# Altium schematic sheet greenhouseSchematic.SchDoc: Greenhouse Project
size 508 x 279 mm; SheetNumber: 1; SheetTotal: 1
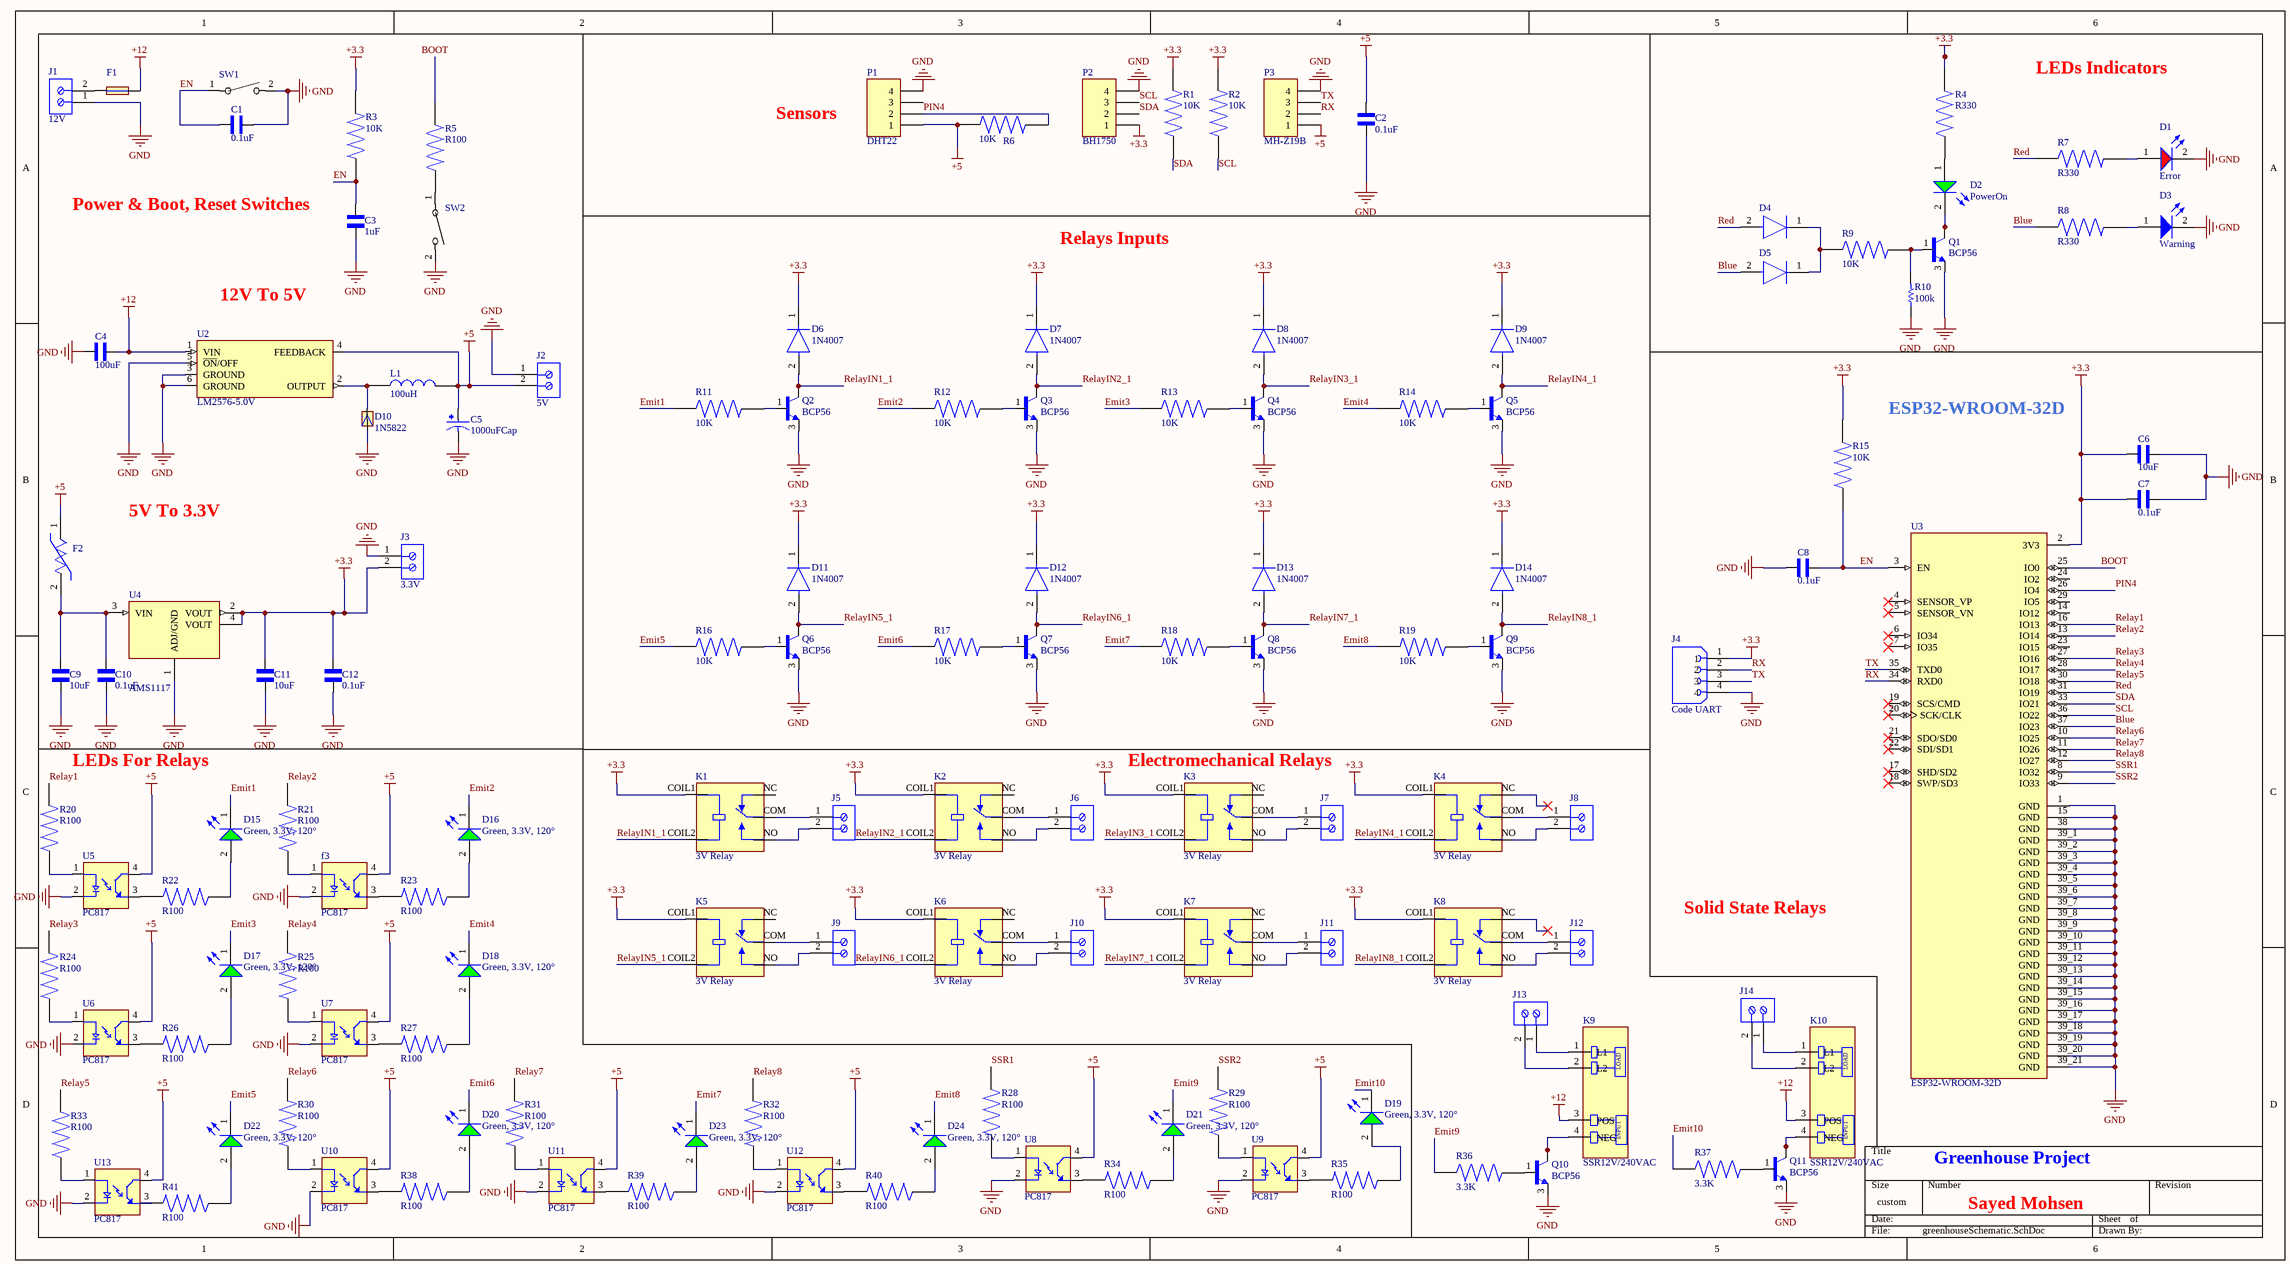
[diagram p0: greenhouseSchematic.SchDoc]

## Parts
C1  0.1uF  [Capacitor0.1uF]
C2  0.1uF  [Capacitor0.1uF]
C3  1uF  [CAPACITOR1UF]
C4  100uF  [Capacitor10uF]
C5  1000uFCap  [1000uFCap]
C6  10uF  [Capacitor10uF]
C7  0.1uF  [Capacitor0.1uF]
C8  0.1uF  [Capacitor0.1uF]
C9  10uF  [Capacitor10uF]
C10  0.1uF  [Capacitor0.1uF]
C11  10uF  [Capacitor10uF]
C12  0.1uF  [Capacitor0.1uF]
D1  Error  [redLed]
D2  PowerOn  [greenLed]
D3  Warning  [blueLed]
D4  1N4007  [1N4007]  (value not drawn)
D5  1N4007  [1N4007]  (value not drawn)
D6  1N4007  [1N4007]
D7  1N4007  [1N4007]
D8  1N4007  [1N4007]
D9  1N4007  [1N4007]
D10  1N5822  [1N5822Diode]
D11  1N4007  [1N4007]
D12  1N4007  [1N4007]
D13  1N4007  [1N4007]
D14  1N4007  [1N4007]
D15  Green, 3.3V, 120°  [newgreenled]
D16  Green, 3.3V, 120°  [newgreenled]
D17  Green, 3.3V, 120°  [newgreenled]
D18  Green, 3.3V, 120°  [newgreenled]
D19  Green, 3.3V, 120°  [newgreenled]
D20  Green, 3.3V, 120°  [newgreenled]
D21  Green, 3.3V, 120°  [newgreenled]
D22  Green, 3.3V, 120°  [newgreenled]
D23  Green, 3.3V, 120°  [newgreenled]
D24  Green, 3.3V, 120°  [newgreenled]
F1  1812L200/12DR  [FUSE_1812L200/12DR]  (value not drawn)
F2  0ZCK0075FF2E  [ptc6v]  (value not drawn)
f3  PC817  [PC817]
J1  12V  [screw]
J2  5V  [screw]
J3  3.3V  [screw]
J4  Code UART  [Fpinheader]
J5  (no value)  [screw]
J6  (no value)  [screw]
J7  (no value)  [screw]
J8  (no value)  [screw]
J9  (no value)  [screw]
J10  (no value)  [screw]
J11  (no value)  [screw]
J12  (no value)  [screw]
J13  (no value)  [screw]
J14  (no value)  [screw]
K1  3V Relay  [3V Relay]
K2  3V Relay  [3V Relay]
K3  3V Relay  [3V Relay]
K4  3V Relay  [3V Relay]
K5  3V Relay  [3V Relay]
K6  3V Relay  [3V Relay]
K7  3V Relay  [3V Relay]
K8  3V Relay  [3V Relay]
K9  SSR12V/240VAC  [SSR12V/240VAC]
K10  SSR12V/240VAC  [SSR12V/240VAC]
L1  100uH  [100uH Inductor]
P1  DHT22  [HDR1X4]
P2  BH1750  [HDR1X4]
P3  MH-Z19B  [HDR1X4]
Q1  BCP56  [BCP56]
Q2  BCP56  [BCP56]
Q3  BCP56  [BCP56]
Q4  BCP56  [BCP56]
Q5  BCP56  [BCP56]
Q6  BCP56  [BCP56]
Q7  BCP56  [BCP56]
Q8  BCP56  [BCP56]
Q9  BCP56  [BCP56]
Q10  BCP56  [BCP56]
Q11  BCP56  [BCP56]
R1  10K  [Resistor10K]
R2  10K  [Resistor10K]
R3  10K  [Resistor10K]
R4  R330  [R100]
R5  R100  [R100]
R6  10K  [Resistor10K]
R7  R330  [R100]
R8  R330  [R100]
R9  10K  [Resistor10K]
R10  100k  [RESC1608X55X30ML15T15]
R11  10K  [Resistor10K]
R12  10K  [Resistor10K]
R13  10K  [Resistor10K]
R14  10K  [Resistor10K]
R15  10K  [Resistor10K]
R16  10K  [Resistor10K]
R17  10K  [Resistor10K]
R18  10K  [Resistor10K]
R19  10K  [Resistor10K]
R20  R100  [R100]
R21  R100  [R100]
R22  R100  [R100]
R23  R100  [R100]
R24  R100  [R100]
R25  R100  [R100]
R26  R100  [R100]
R27  R100  [R100]
R28  R100  [R100]
R29  R100  [R100]
R30  R100  [R100]
R31  R100  [R100]
R32  R100  [R100]
R33  R100  [R100]
R34  R100  [R100]
R35  R100  [R100]
R36  3.3K  [Resistor10K]
R37  3.3K  [Resistor10K]
R38  R100  [R100]
R39  R100  [R100]
R40  R100  [R100]
R41  R100  [R100]
SW1  PTS636 SM25F SMTR LFS  [Switch12v]  (value not drawn)
SW2  PTS636 SM25F SMTR LFS  [Switch12v]  (value not drawn)
U2  LM2576-5.0V  [LM2576-5V]
U3  ESP32-WROOM-32D  [ESP32-WROOM-32D]
U4  AMS1117  [VG 5 - 3.3]
U5  PC817  [PC817]
U6  PC817  [PC817]
U7  PC817  [PC817]
U8  PC817  [PC817]
U9  PC817  [PC817]
U10  PC817  [PC817]
U11  PC817  [PC817]
U12  PC817  [PC817]
U13  PC817  [PC817]

## Nets
+3.3: C6.1 C7.1 C11.1 C12.2 D6.1(C) D7.1(C) D8.1(C) D9.1(C) D11.1(C) D12.1(C) D13.1(C) D14.1(C) J3.2 J4.1 K1.COIL1 K2.COIL1 K3.COIL1 K4.COIL1 K5.COIL1 K6.COIL1 K7.COIL1 K8.COIL1 P2.1 R1.2 R2.2 R3.2 R4.1 R15.2 U3.2(3V3) U4.2(VOUT) U4.4(VOUT)
+5: C2.2 C5.1 F2.1 f3.4(CT) J2.2 L1.2 P1.1 P3.1 R6.1 U2.4(FEEDBACK) U5.4(CT) U6.4(CT) U7.4(CT) U8.4(CT) U9.4(CT) U10.4(CT) U11.4(CT) U12.4(CT) U13.4(CT)
+12: C4.1 F1.2 K9.3(POS) K10.3(POS) U2.1(VIN)
GND: C1.2 C2.1 C3.1 C4.2 C5.2 C6.2 C7.2 C8.1 C9.2 C10.1 C11.2 C12.1 D1.2(K) D3.2(K) D10.A f3.2(C) J1.1 J2.1 J3.1 J4.4 P1.4 P2.4 P3.4 Q1.3(E) Q2.3(E) Q3.3(E) Q4.3(E) Q5.3(E) Q6.3(E) Q7.3(E) Q8.3(E) Q9.3(E) Q10.3(E) Q11.3(E) R10.1 SW1.2 SW2.2 U2.3(GROUND) U2.5(~{ON}/OFF) U2.6(GROUND) U3.1(GND) U3.15(GND) U3.38(GND) U3.39_1(GND) U3.39_2(GND) U3.39_3(GND) U3.39_4(GND) U3.39_5(GND) U3.39_6(GND) U3.39_7(GND) U3.39_8(GND) U3.39_9(GND) U3.39_10(GND) U3.39_11(GND) U3.39_12(GND) U3.39_13(GND) U3.39_14(GND) U3.39_15(GND) U3.39_16(GND) U3.39_17(GND) U3.39_18(GND) U3.39_19(GND) U3.39_20(GND) U3.39_21(GND) U4.1(ADJ/GND) U5.2(C) U6.2(C) U7.2(C) U8.2(C) U9.2(C) U10.2(C) U11.2(C) U12.2(C) U13.2(C)
Blue: D5.2(A) R8.1 U3.37(IO23)
BOOT: R5.1 U3.25(IO0)
Emit1: D15.1(K) R11.1
Emit2: D16.1(K) R12.1
Emit3: D17.1(K) R13.1
Emit4: D18.1(K) R14.1
Emit5: D22.1(K) R16.1
Emit6: D20.1(K) R17.1
Emit7: D23.1(K) R18.1
Emit8: D24.1(K) R19.1
Emit9: D21.1(K) R36.1
Emit10: D19.1(K) R37.1
EN: C1.1 C3.2 C8.2 R3.1 R15.1 SW1.1 U3.3(EN)
PIN4: P1.2 R6.2 U3.26(IO4)
Red: D4.2(A) R7.1 U3.31(IO19)
Relay1: R20.2 U3.16(IO13)
Relay2: R21.2 U3.13(IO14)
Relay3: R24.2 U3.27(IO16)
Relay4: R25.2 U3.28(IO17)
Relay5: R33.2 U3.30(IO18)
Relay6: R30.2 U3.10(IO25)
Relay7: R31.2 U3.11(IO26)
Relay8: R32.2 U3.12(IO27)
RelayIN1_1: D6.2(A) K1.COIL2 Q2.2(C) Q2.4(C)
RelayIN2_1: D7.2(A) K2.COIL2 Q3.2(C) Q3.4(C)
RelayIN3_1: D8.2(A) K3.COIL2 Q4.2(C) Q4.4(C)
RelayIN4_1: D9.2(A) K4.COIL2 Q5.2(C) Q5.4(C)
RelayIN5_1: D11.2(A) K5.COIL2 Q6.2(C) Q6.4(C)
RelayIN6_1: D12.2(A) K6.COIL2 Q7.2(C) Q7.4(C)
RelayIN7_1: D13.2(A) K7.COIL2 Q8.2(C) Q8.4(C)
RelayIN8_1: D14.2(A) K8.COIL2 Q9.2(C) Q9.4(C)
RX: J4.2 P3.2 U3.34(RXD0)
SCL: P2.3 R2.1 U3.36(IO22)
SDA: P2.2 R1.1 U3.33(IO21)
SSR1: R28.2 U3.8(IO32)
SSR2: R29.2 U3.9(IO33)
TX: J4.3 P3.3 U3.35(TXD0)
NetC9_1: C9.1 C10.2 F2.2 U4.3(VIN)
NetD1_1: D1.1(A) R7.2
NetD2_1: D2.1(A) R4.2
NetD2_2: D2.2(K) Q1.2(C) Q1.4(C)
NetD3_1: D3.1(A) R8.2
NetD4_1: D4.1(C) D5.1(C) R9.1
NetD10_C: D10.C L1.1 U2.2(OUTPUT)
NetD15_2: D15.2(A) R22.1
NetD16_2: D16.2(A) R23.1
NetD17_2: D17.2(A) R26.1
NetD18_2: D18.2(A) R27.1
NetD19_2: D19.2(A) R35.1
NetD20_2: D20.2(A) R38.1
NetD21_2: D21.2(A) R34.1
NetD22_2: D22.2(A) R41.1
NetD23_2: D23.2(A) R39.1
NetD24_2: D24.2(A) R40.1
NetF1_1: F1.1 J1.2
Netf3_1: f3.1(A) R21.1
Netf3_3: f3.3(ET) R23.2
NetJ5_1: J5.1 K1.COM
NetJ5_2: J5.2 K1.NO
NetJ6_1: J6.1 K2.COM
NetJ6_2: J6.2 K2.NO
NetJ7_1: J7.1 K3.COM
NetJ7_2: J7.2 K3.NO
NetJ8_1: J8.1 K4.COM
NetJ8_2: J8.2 K4.NO
NetJ9_1: J9.1 K5.COM
NetJ9_2: J9.2 K5.NO
NetJ10_1: J10.1 K6.COM
NetJ10_2: J10.2 K6.NO
NetJ11_1: J11.1 K7.COM
NetJ11_2: J11.2 K7.NO
NetJ12_1: J12.1 K8.COM
NetJ12_2: J12.2 K8.NO
NetJ13_1: J13.1 K9.1(L1)
NetJ13_2: J13.2 K9.2(L2)
NetJ14_1: J14.1 K10.1(L1)
NetJ14_2: J14.2 K10.2(L2)
NetK9_4: K9.4(NEG) Q10.2(C) Q10.4(C)
NetK10_4: K10.4(NEG) Q11.2(C) Q11.4(C)
NetQ1_1: Q1.1(B) R9.2 R10.2
NetQ2_1: Q2.1(B) R11.2
NetQ3_1: Q3.1(B) R12.2
NetQ4_1: Q4.1(B) R13.2
NetQ5_1: Q5.1(B) R14.2
NetQ6_1: Q6.1(B) R16.2
NetQ7_1: Q7.1(B) R17.2
NetQ8_1: Q8.1(B) R18.2
NetQ9_1: Q9.1(B) R19.2
NetQ10_1: Q10.1(B) R36.2
NetQ11_1: Q11.1(B) R37.2
NetR5_2: R5.2 SW2.1
NetR20_1: R20.1 U5.1(A)
NetR22_2: R22.2 U5.3(ET)
NetR24_1: R24.1 U6.1(A)
NetR25_1: R25.1 U7.1(A)
NetR26_2: R26.2 U6.3(ET)
NetR27_2: R27.2 U7.3(ET)
NetR28_1: R28.1 U8.1(A)
NetR29_1: R29.1 U9.1(A)
NetR30_1: R30.1 U10.1(A)
NetR31_1: R31.1 U11.1(A)
NetR32_1: R32.1 U12.1(A)
NetR33_1: R33.1 U13.1(A)
NetR34_2: R34.2 U8.3(ET)
NetR35_2: R35.2 U9.3(ET)
NetR38_2: R38.2 U10.3(ET)
NetR39_2: R39.2 U11.3(ET)
NetR40_2: R40.2 U12.3(ET)
NetR41_2: R41.2 U13.3(ET)

Not connected (* = marked no-connect by the designer): K1 NC; K2 NC; K3 NC; K4 NC*; K5 NC; K6 NC; K7 NC; K8 NC*; P1 3; U3 4(SENSOR_VP)* 5(SENSOR_VN)* 6(IO34)* 7(IO35)* 14(IO12) 17(SHD/SD2)* 18(SWP/SD3)* 19(SCS/CMD)* 20(SCK/CLK)* 21(SDO/SD0)* 22(SDI/SD1)* 23(IO15) 24(IO2) 29(IO5)

## Notes on the sheet
- LEDs Indicators
- Sensors
- (near C3) Power & Boot, Reset Switches
- Relays Inputs
- 12V To 5V
- ESP32-WROOM-32D
- 5V To 3.3V
- LEDs For Relays
- (near K3) Electromechanical Relays
- Solid State Relays
- Sayed Mohsen
- (in symbol SSR12V/240VAC) LOAD; INPUT

## Library data of the parts
C1 C2 C7 C8 C10 C12 = Capacitor0.1uF: SMD Capacitor X7S(EIA) with Capacitance: 0.10uF Tol. 10%. Rated Voltage: 16Vdc; MF: Murata; MP: GRM033C71C104KE14D; SnapEDA_Link: https://www.snapeda.com/parts/GRM033C71C104KE14D/Murata/view-part/?ref=snap; Package: 0603 Murata; Check_prices: https://www.snapeda.com/parts/GRM033C71C104KE14D/Murata/view-part/?ref=eda
  C1 C2 C7 C8: Value: *
  C10 C12: Value: 0.1uF
C3 = Capacitor1uF: SMD capacitor X5R(EIA) with capacitance 1.0uF Tol.20%. Rated voltage 10Vdc 85C; MF: Murata; MP: GRM033R61A105ME44J; SnapEDA_Link: https://www.snapeda.com/parts/GRM033R61A105ME44J/Murata/view-part/?ref=snap; Package: 1005 Murata; Value: *; Check_prices: https://www.snapeda.com/parts/GRM033R61A105ME44J/Murata/view-part/?ref=eda
C4 C6 C9 C11 = Capacitor10uF: SMD Capacitor X5R(EIA) with Capacitance: 10uF Tol. 10%. Rated Voltage: 10Vdc; MF: Murata; MP: GRM21BR61A106KE19K; SnapEDA_Link: https://www.snapeda.com/parts/GRM21BR61A106KE19K/Murata/view-part/?ref=snap; Package: 805-2 Murata; Check_prices: https://www.snapeda.com/parts/GRM21BR61A106KE19K/Murata/view-part/?ref=eda
  C4 C6 C9: Value: *
  C11: Value: 10uF
C5 = 1000uFCap: CAP ALUM 1000UF 20% 10V SMD; MP: EEE-FN1A102P; MF: Panasonic Electronic Components; Package: RADIAL-2 Panasonic; Availability: In Stock; Price: None; Check_prices: https://www.snapeda.com/parts/EEE-FN1A102P/Panasonic/view-part/6178528/?ref=eda; Purchase-URL: https://pricing.snapeda.com/search/part/EEE-FN1A102P/?ref=eda; Value: *; SnapEDA_Link: https://www.snapeda.com/parts/EEE-FN1A102P/Panasonic/view-part/6178528/?ref=snap
D1 = redLed: NexarPartId: 29717813; Lens Style: Circular, Diffused, Round; Lens Size: 5mm; Forward Voltage: 2.1V; Peak Wavelength: 650nm; Forward Current: 100mA; Viewing Angle: 60°; Color: Red; Wavelength: 630nm; Test Current: 20mA; Dominant Wavelength: 645nm; Luminous Intensity: 30mcd; Max Reverse Voltage (DC): 5V; Height: 8.6mm; Length: 5mm; Min Operating Temperature: -40°C; Max Operating Temperature: 85°C; Packaging: Bulk; REACH SVHC: Unknown; Case/Package: Radial; RoHS: Compliant; Width: 5mm; Mount: Through Hole
D2 = greenLed: NexarPartId: 29717805; Peak Wavelength: 560nm; Lens Style: Circular, Diffused, Round; Forward Voltage: 2.2V; Lens Size: 3mm; Wavelength: 568nm; Test Current: 20mA; Max Reverse Voltage (DC): 5V; Color: Green; Forward Current: 100mA; Viewing Angle: 60°; Luminous Intensity: 30mcd; Case/Package: Radial; RoHS: Compliant; Packaging: Bulk; Max Operating Temperature: 85°C; Lead Free: Lead Free; Min Operating Temperature: -40°C; Length: 3mm; Width: 3mm; REACH SVHC: Unknown; Mount: Through Hole; Height: 5.3mm; Dominant Wavelength: 568nm
D3 = blueLed: NexarPartId: 29717812; Test Current: 20mA; Forward Voltage: 3.2V; Wavelength: 470nm; Lens Size: 5mm; Lens Style: Circular, Diffused, Round; Forward Current: 100mA; Peak Wavelength: 465nm; Viewing Angle: 40°; Luminous Intensity: 500mcd; Max Reverse Voltage (DC): 5V; Color: Blue; Case/Package: Radial; Width: 5mm; Mount: Through Hole; Min Operating Temperature: -40°C; Length: 5mm; Height: 8.6mm; Max Operating Temperature: 85°C; Packaging: Bulk; RoHS: Compliant; REACH SVHC: Unknown; Dominant Wavelength: 470nm
D4-D9 D11-D14 = 1N4007: Rectifier diode 1000 V 1 A DO-41, ,; Manufacturer: Diotec; Max Surge Forward Current: 27A; Forward Current: 1A; Max Junction Temp: +175°C; Reverse Voltage: 1000V; Value: 15pF; Peak Reverse Current: 5uA; Category: Diode; Temperature Range Low: -50°C; Automotive: No; Temperature: -50°C to +175°C; Lead Free: Yes; ComponentLink2Description: Datasheet; Max Repetitive Reverse Voltage: 1000V; ComponentLink2URL: https://datasheet.octopart.com/1N4007-Diotec-datasheet-62346875.pdf; Manufacturer Part Number: 1N4007; Device Class L3: Rectifier Diodes; Height: 2.8mm; Octopart: https://octopart.com/1n4007-diotec-4040411; Package: 1N4007; Temperature Range High: +175°C; Device Class L1: Discrete Semiconductors; Device Class L2: Diodes; RoHS: TRUE; Capacitance: 15pF; Ipc Land Pattern Name: DIOAD888W100L520D280
D10 = 1N5822 Diode: Schottky, DO-201, 40V, 3A, 150Â°C; MF: Diotec Semiconductor; SnapEDA_Link: https://www.snapeda.com/parts/1N5822/Diotec/view-part/?ref=snap; Package: DO-201 Diotec; Value: *; MP: 1N5822; Check_prices: https://www.snapeda.com/parts/1N5822/Diotec/view-part/?ref=eda
D15-D24 = GreenLed_1: WL-SMCC Mono-color Chip LED Compact, SMT, size 0402, Green, 3.3V, 120°; Manufacturer Part Number: 150040GS73220; Manufacturer: Wurth Elektronik; Case/Size Code: 0402; Chip Technology: InGaN; Dominant Wavelength: 525nm; Luminous Intensity: 750mcd; Peak Wavelength: 520nm; Category: Signal LEDs; Match Code: WL-SMCC; ComponentLink1Description: Website Link; ComponentLink1URL: https://www.we-online.com/redexpert/article/150040GS73220?ad; ComponentLink2Description: Datasheet Link; ComponentLink2URL: https://www.we-online.com/redexpert/spec/150040GS73220?ad; Mount: Surface Mount; Operating Temperature Max: 85°C; Operating Temperature Min: -40°C; Packaging: Tape and Reel; Length: 1mm; Width: 0.5mm; Height: 0.25mm; Emitting Color: Green; Forward Voltage: 3.3V; Viewing Angle: 120°
F1 = 1812L200/12DR: Polymeric PTC Resettable Fuse 12V 2A Ih Surface Mount 1812 (4532 Metric), Concave; MF: Littelfuse Inc.; Mouser-Purchase-URL: https://snapeda.com/shop?store=Mouser&id=1314296; Value: *; Availability: Warning; Price: None; SnapEDA_Link: https://www.snapeda.com/parts/1812L200/12DR/Littelfuse%20Inc./view-part/1314296/?ref=snap; Package: 1812 Littelfuse; MP: 1812L200/12DR
F2 = ptc6v: PTC RESET FUSE 6V 750MA 0805; Time to Trip: 0.2s; Trip Current: 1.5A; Max Current Rating: 40A; Hold Current: 750mA; Case Code (Metric): 2012; Packaging: Tape and Reel; Lead Free: Lead Free; Package Quantity: 1; Case Code (Imperial): 0805; Case/Package: 0805
f3 U5-U13 = PC817: Optocoupler DC-IN 1-CH Transistor DC-OUT 4-Pin DIP SMD T/R; MF: Sharp Microelectronics; MP: PC817X2NIP1B; SnapEDA_Link: https://www.snapeda.com/parts/PC817X2NIP1B/Sharp+Microelectronics/view-part/?ref=snap; Package: SMD-4 Sharp Microelectronics; Value: *; Check_prices: https://www.snapeda.com/parts/PC817X2NIP1B/Sharp+Microelectronics/view-part/?ref=eda
J1-J3 J5-J14 = screw: NexarPartId: 78871135; Voltage Rating: 300V; Number of Contacts: 2; Current Rating: 16A; Lead Pitch: 5mm; Height: 11.6mm; Packaging: Box; RoHS: Non-Compliant; Contact Material: Nickel, Tin; Max Operating Temperature: 120°C; Number of Pins: 2; Min Operating Temperature: -30°C; Number of Rows: 1
J4 = FPinheader: 4 Position Header Connector 0.100 (2.54mm) Through Hole Tin; MF: Sullins Connector; MP: PPTC041LFBN-RC; SnapEDA_Link: https://www.snapeda.com/parts/PPTC041LFBN-RC/Sullins/view-part/?ref=snap; Package: None; Value: *; Check_prices: https://www.snapeda.com/parts/PPTC041LFBN-RC/Sullins/view-part/?ref=eda
K1-K8 = 3V Relay: Relays General Purpose Non Latching 3VDC SPDT 10A (250VAC) Max 5PIN; MF: Songle Relay; MP: SRD-03VDC-SL-C; SnapEDA_Link: https://www.snapeda.com/parts/SRD-03VDC-SL-C/Songle+Relay/view-part/?ref=snap; Package: NON STANDARD-5 Songle Relay; Value: *; Check_prices: https://www.snapeda.com/parts/SRD-03VDC-SL-C/Songle+Relay/view-part/?ref=eda
K9 K10 = SSR12V/240VAC: Solid State SPST-NO (1 Form A) 4-SIP; MF: Omron Automation; MP: G3MB-202P DC12; SnapEDA_Link: https://www.snapeda.com/parts/G3MB-202P%20DC12/Omron/view-part/?ref=snap; Package: SIP-4 Omron Automation; Value: *; Check_prices: https://www.snapeda.com/parts/G3MB-202P%20DC12/Omron/view-part/?ref=eda
L1 = 100uH Inductor: Inductor with Inductance 100uH Tol.+/-20% Package 1212 (3030); MF: Murata; MP: LQH3NPH101MMEL; Availability: In Stock; SnapEDA_Link: https://www.snapeda.com/parts/LQH3NPH101MMEL/Murata/view-part/?ref=snap; Price: None; Check_prices: https://www.snapeda.com/parts/LQH3NPH101MMEL/Murata/view-part/?ref=eda; Package: 1212 Murata; Value: *; Purchase-URL: https://pricing.snapeda.com/search/part/LQH3NPH101MMEL/?ref=eda
P1-P3 = Header 4: Header, 4-Pin; LatestRevisionDate: 17-Jul-2002; LatestRevisionNote: Re-released for DXP Platform.; Publisher: Altium Limited
Q1-Q11 = BCP56: Bipolar (BJT) Transistor NPN 80 V 1 A 130MHz 1.5 W Surface Mount SOT-223 (TO-261); MF: ON Semiconductor; SnapEDA_Link: https://www.snapeda.com/parts/BCP56/Onsemi/view-part/?ref=snap; Package: TO-261-4 ON Semiconductor / Fairchild; Value: *; MP: BCP56; Check_prices: https://www.snapeda.com/parts/BCP56/Onsemi/view-part/?ref=eda
R1-R3 R6 R9 R11-R19 R36 R37 = Resistor10K: Res Thick Film 0201 10K Ohm 1% 1/20W 200ppm/C Molded SMD SMD Pressed Carrier T/R; MF: Panasonic; MP: ERJ-U01F1002C; Price: None; SnapEDA_Link: https://www.snapeda.com/parts/ERJ-U01F1002C/Panasonic/view-part/5830665/?ref=snap; Check_prices: https://www.snapeda.com/parts/ERJ-U01F1002C/Panasonic/view-part/5830665/?ref=eda; Package: 0603-2 Panasonic
  R1-R3 R6 R9 R11-R18 R36 R37: Value: *
  R19: Value: 10k
R4 R7 R8 R20-R35 R38-R41 = R100: Res Thin Film 0402 100 Ohm 0.5% 0.063W(1/16W) Â±25ppm/C Molded SMD Paper T/R; MF: Stackpole Electronics Inc; MP: RNCF0402DTE100R; SnapEDA_Link: https://www.snapeda.com/parts/RNCF0402DTE100R/Stackpole+Electronics/view-part/?ref=snap; Package: 1005 Stackpole; Value: *; Check_prices: https://www.snapeda.com/parts/RNCF0402DTE100R/Stackpole+Electronics/view-part/?ref=eda
R5 = R100: Res Thin Film 0402 100 Ohm 0.5% 0.063W(1/16W) Â±25ppm/C Molded SMD Paper T/R; Value: 100; MF: Stackpole Electronics Inc; MP: RNCF0402DTE100R; SnapEDA_Link: https://www.snapeda.com/parts/RNCF0402DTE100R/Stackpole+Electronics/view-part/?ref=snap; Package: 1005 Stackpole; Check_prices: https://www.snapeda.com/parts/RNCF0402DTE100R/Stackpole+Electronics/view-part/?ref=eda
R10 = CMP-2000-00182-1: Part Number: ERJ-3EKF1003V; Manufacturer: Panasonic
SW1 SW2 = Switch12v: Description; Manufacturer_Name: C&K Components; Copyright: Copyright (C) 2025 Ultra Librarian. All rights reserved.; Manufacturer_Part_Number: PTS636 SM25F SMTR LFS
U2 = LM2576-5.0V: Buck Switching Regulator IC Positive Fixed 5V 1 Output 3A TO-263-6, D2PAK (5 Leads + Tab), TO-263BA; MF: Microchip; MP: LM2576-5.0WU; SnapEDA_Link: https://www.snapeda.com/parts/LM2576-5.0WU/Microchip/view-part/?ref=snap; Package: TO-263-5 Micrel; Value: *; Check_prices: https://www.snapeda.com/parts/LM2576-5.0WU/Microchip/view-part/?ref=eda
U3 = ESP32-WROOM-32D: Bluetooth, WiFi 802.11b/g/n, Bluetooth v4.2 +EDR, Class 1, 2 and 3 Transceiver Module 2.4GHz ~ 2.5GHz Integrated; MF: Espressif Systems; SnapEDA_Link: https://www.snapeda.com/parts/ESP32-WROOM-32D/Espressif+Systems/view-part/?ref=snap; Package: Non Standard Espressif Systems; Value: *; MP: ESP32-WROOM-32D; Check_prices: https://www.snapeda.com/parts/ESP32-WROOM-32D/Espressif+Systems/view-part/?ref=eda
U4 = VG 5 - 3.3: 1A LOW DROPOUT VOLTAGE REGULATOR SOT-223; MF: Advanced Monolithic Systems; SnapEDA_Link: https://www.snapeda.com/parts/AMS1117/Advanced+Monolithic+Systems/view-part/?ref=snap; Package: SOT-223 Seeed Technology; Value: *; MP: AMS1117; Check_prices: https://www.snapeda.com/parts/AMS1117/Advanced+Monolithic+Systems/view-part/?ref=eda